# Altium schematic sheet Master.SchDoc
size A; SheetNumber: 1; SheetTotal: 2
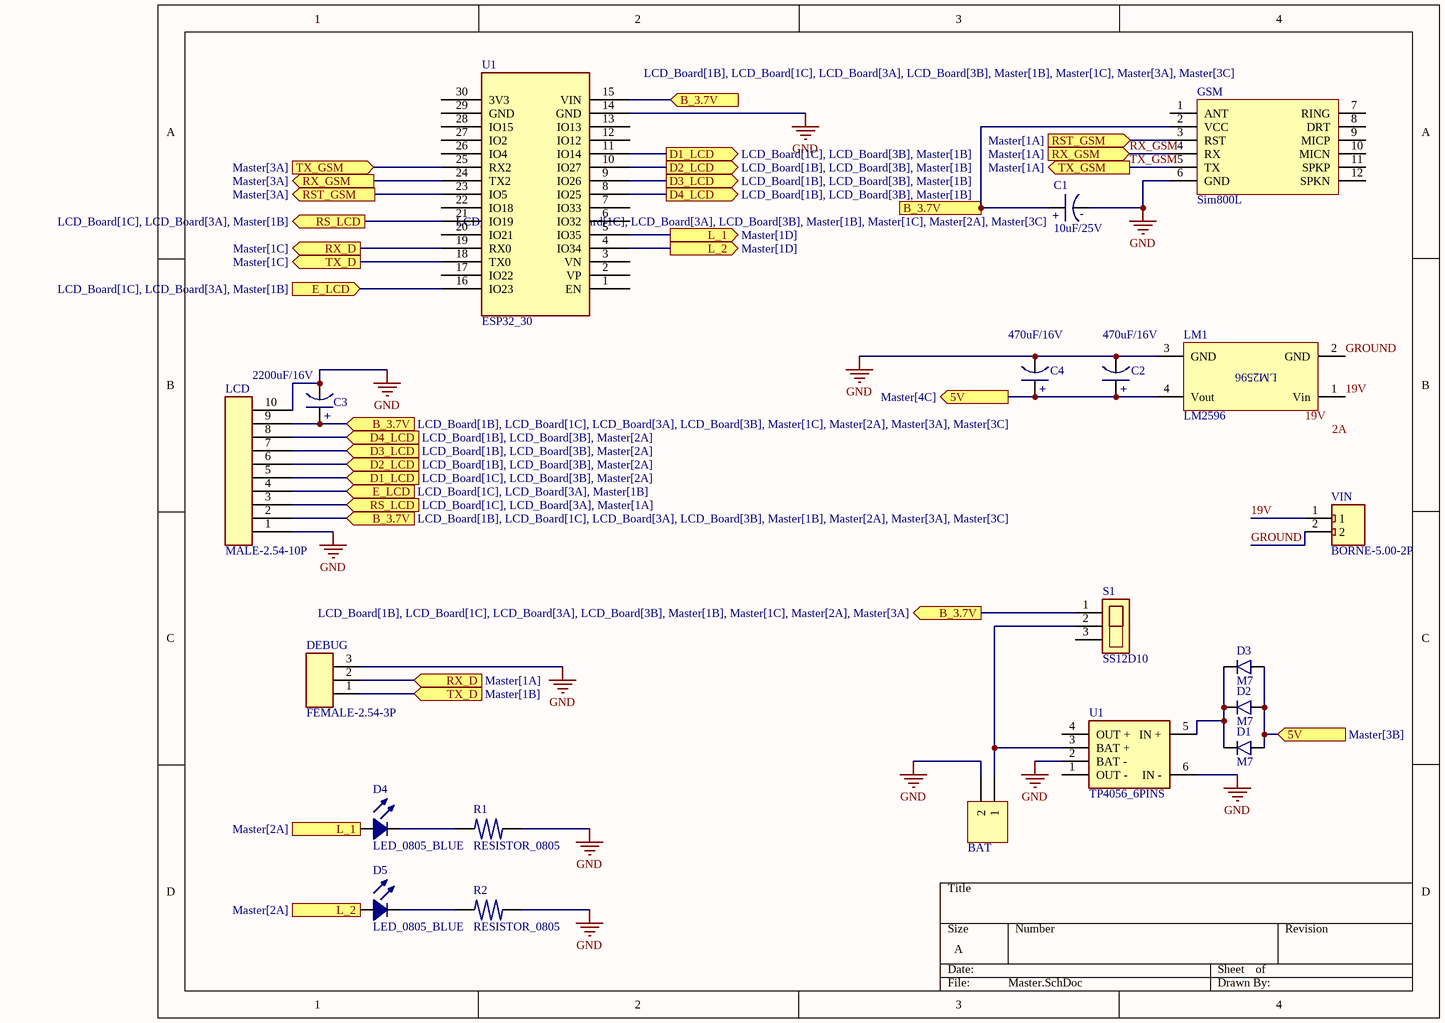
[diagram p0: Master.SchDoc]

## Parts
(Parts that share a designator on the sheet are numbered #1, #2 ... from top to bottom, then left to right.)
BAT  (no value)  [HDR1X2]
C1  10uF/25V  [10uF/25V 5mm]
C2  470uF/16V  [470uF/16V]
C3  2200uF/16V  [470uF/16V]
C4  470uF/16V  [470uF/16V]
D1  M7  [DIODE_SMA]
D2  M7  [DIODE_SMA]
D3  M7  [DIODE_SMA]
D4  LED_0805_BLUE  [LED_0805_BLUE]
D5  LED_0805_BLUE  [LED_0805_BLUE]
DEBUG  FEMALE-2.54-3P  [FEMALE-2.54-3P]
GSM  Sim800L  [Sim800L]
LCD  MALE-2.54-10P  [MALE-2.54-10P]
LM1  LM2596  [lm2596]
R1  RESISTOR_0805  [RESISTOR_0805]
R2  RESISTOR_0805  [RESISTOR_0805]
S1  SS12D10  [SS12D10]
U1#1  ESP32_30  [ESP32_30]
U1#2  TP4056_6PINS  [TP4056_6PINs]
VIN  BORNE-5.00-2P  [BORNE-5.00-2P]

## Ports
5V (in, see Master[3B]), 5V (out, see Master[4C]), B_3.7V (in, see LCD_Board[1B], LCD_Board[1C], LCD_Board[3A], LCD_Board[3B], Master[1B], Master[1C], Master[2A], Master[3C]), B_3.7V (in, see LCD_Board[1B], LCD_Board[1C], LCD_Board[3A], LCD_Board[3B], Master[1B], Master[1C], Master[3A], Master[3C]), B_3.7V (in, see LCD_Board[1B], LCD_Board[1C], LCD_Board[3A], LCD_Board[3B], Master[1B], Master[2A], Master[3A], Master[3C]), B_3.7V (in, see LCD_Board[1B], LCD_Board[1C], LCD_Board[3A], LCD_Board[3B], Master[1C], Master[2A], Master[3A], Master[3C]), B_3.7V (out, see LCD_Board[1B], LCD_Board[1C], LCD_Board[3A], LCD_Board[3B], Master[1B], Master[1C], Master[2A], Master[3A]), D1_LCD (in, see LCD_Board[1C], LCD_Board[3B], Master[2A]), D1_LCD (out, see LCD_Board[1C], LCD_Board[3B], Master[1B]), D2_LCD (in, see LCD_Board[1B], LCD_Board[3B], Master[2A]), D2_LCD (out, see LCD_Board[1B], LCD_Board[3B], Master[1B]), D3_LCD (in, see LCD_Board[1B], LCD_Board[3B], Master[2A]), D3_LCD (out, see LCD_Board[1B], LCD_Board[3B], Master[1B]), D4_LCD (in, see LCD_Board[1B], LCD_Board[3B], Master[2A]), D4_LCD (out, see LCD_Board[1B], LCD_Board[3B], Master[1B]), E_LCD (in, see LCD_Board[1C], LCD_Board[3A], Master[1B]), L_1 (in, see Master[2A]), L_1 (out, see Master[1D]), L_2 (in, see Master[2A]), L_2 (out, see Master[1D]), RS_LCD (in, see LCD_Board[1C], LCD_Board[3A], Master[1A]), RS_LCD (out, see LCD_Board[1C], LCD_Board[3A], Master[1B]), RST_GSM (in, see Master[1A]), RST_GSM (out, see Master[3A]), RX_D (in, see Master[1A]), RX_D (out, see Master[1C]), RX_GSM (in, see Master[1A]), RX_GSM (out, see Master[3A]), TX_D (in, see Master[1B]), TX_D (out, see Master[1C]), TX_GSM (in, see Master[3A]), TX_GSM (out, see Master[1A])

## Nets
GND: BAT.2 C1.1 C2.1 C3.1 C4.1 DEBUG.3 GSM.6(GND) LCD.1 LCD.10 LM1.3(GND) R1.2 R2.2 U1#1.14(GND) U1#2.2(BAT_-) U1#2.6(IN_-)
5V: C2.2 C4.2 D1.1 D2.1 D3.1 LM1.4(Vout) ; port 5V
19V: LM1.1(Vin) VIN.1
B_3.7V: C1.2 C3.2 GSM.2(VCC) LCD.2 LCD.9 S1.1 U1#1.15(VIN) ; port B_3.7V
D1_LCD: LCD.5 U1#1.11(IO14) ; port D1_LCD
D2_LCD: LCD.6 U1#1.10(IO27) ; port D2_LCD
D3_LCD: LCD.7 U1#1.9(IO26) ; port D3_LCD
D4_LCD: LCD.8 U1#1.8(IO25) ; port D4_LCD
E_LCD: LCD.4 U1#1.16(IO23) ; port E_LCD
GROUND: LM1.2(GND) VIN.2
L_1: D4.1 U1#1.5(IO35) ; port L_1
L_2: D5.1 U1#1.4(IO34) ; port L_2
RS_LCD: LCD.3 U1#1.21(IO19) ; port RS_LCD
RST_GSM: GSM.3(RST) U1#1.23(IO5) ; port RST_GSM
RX_D: DEBUG.2 U1#1.19(RX0) ; port RX_D
RX_GSM: GSM.4(RX) U1#1.24(TX2) ; port RX_GSM
TX_D: DEBUG.1 U1#1.18(TX0) ; port TX_D
TX_GSM: GSM.5(TX) U1#1.25(RX2) ; port TX_GSM
NetBAT_1: BAT.1 S1.2 U1#2.3(BAT_+)
NetD1_2: D1.2 D2.2 D3.2 U1#2.5(IN_+)
NetD4_2: D4.2 R1.1
NetD5_2: D5.2 R2.1

Not connected (* = marked no-connect by the designer): GSM 1(ANT) 7(RING) 8(DRT) 9(MICP) 10(MICN) 11(SPKP) 12(SPKN); S1 3; U1#1 1(EN) 2(VP) 3(VN) 6(IO32) 7(IO33) 12(IO12) 13(IO13) 17(IO22) 20(IO21) 22(IO18) 26(IO4) 27(IO2) 28(IO15) 29(GND) 30(3V3); U1#2 1(OUT_-) 4(OUT_+)

## Notes on the sheet
- (near LM1) 19V
- (near LM1) 2A
- (in symbol 10uF/25V) +; -
- (in symbol 470uF/16V) +

## Library data of the parts
BAT = Header 2: Header, 2-Pin; LatestRevisionDate: 17-Jul-2002; LatestRevisionNote: Re-released for DXP Platform.; Publisher: Altium Limited
C1 = 10uF/25V: Electrolytic Capacitor 10uF/25V
C2-C4 = 470uF/16V: Electrolytic Capacitor 470uF/16V
D1-D3 = M7: Rectifiers Diode 1000V 1A SMA; ComponentLink1Description: Datasheet; Mouser PN: 637-M7; Digikey PN: 3191-M7CT-ND; JLCPCB PN: C330214
D4 D5 = LED_0805_BLUE: LED 0805 Blue.; JLCPCB PN: C131208
DEBUG = FEMALE-2.54-3P: Female Header Connector 2.54mm 3 Pins.; JLCPCB PN: C5116529
LCD = MALE-2.54-10P: Male Header Connector 2.54mm 10 Pins.; JLCPCB PN: C492409
LM1 = LM2596-Adj: Designed By @Alixahedi
R1 R2 = RESISTOR_0805: Generic Resistor 0805.
S1 = SS12D10: Vertical Slide Switch 3 Pins 6.7x12.7x6.4mm.; JLCPCB PN: C2887259
U1#1 = ESP32_30: Microcontoller Board 30 Pins Wifi 2.4GHz BLE 4.2 ESP32-WROOM-32D; ComponentLink1Description: Datasheet; ComponentLink1URL: https://www.mouser.com/datasheet/2/891/esp32_wroom_32d_esp32_wroom_32u_datasheet_en-1365844.pdf
U1#2 = TP4056_6PINS: MODULE BATTERY CHARGER 6 PINS
VIN = BORNE-5.00-2P: Borne 2 Vias, Pitch 5mm.; JLCPCB PN: C91153